# Altium schematic sheet CAN.SchDoc
size Letter
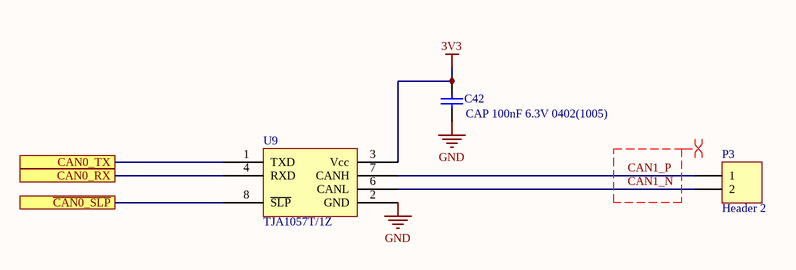
[diagram p0: CAN.SchDoc]

## Parts
C42  CAP 100nF 6.3V 0402(1005)  [CAPC0402(1005)60_M]
P3  Header 2  [HDR1X2]
U9  TJA1057T/1Z  [SOIC127P600X175-8N]

## Ports
CAN0_RX, CAN0_TX, ~{CAN0_SLP}

## Nets
3V3: C42.2 U9.3(Vcc)
GND: C42.1 U9.2(GND)
~{CAN0_SLP}: U9.8(~{SLP}) ; port ~{CAN0_SLP}
CAN0_RX: U9.4(RXD) ; port CAN0_RX
CAN0_TX: U9.1(TXD) ; port CAN0_TX
CAN1_N: P3.2 U9.6(CANL)
CAN1_P: P3.1 U9.7(CANH)

## Layout directives
differential pair: CAN1_N, CAN1_P

## Notes on the sheet
- Title
- Size:
- Date:
- Letter
- Number:
- Time:
- Revision:
- Sheet
- of
- Copyright 2019
- Specialized Solutions LLC
- 206 W Lincoln Hwy STE B
- New Haven, IN 46774
- www.specsolns.com <http://www.specsolns.com>
- File:

## Library data of the parts
C42 = CMP-1034-02062-1: CAP 100nF 6.3V ±20% 0402 (1005 Metric) Thickness 0.6mm SMD; Case-EIA: 0402; Tolerance: Â±20%; Case-Metric: 1005; Value: 100nF; Technology: SMT; Max Thickness: 0.6 mm; Rated Voltage: 6.3 V
P3 = Header 2: Header, 2-Pin; LatestRevisionDate: 17-Jul-2002; LatestRevisionNote: Re-released for DXP Platform.; Publisher: Altium Limited
U9 = TJA1057T/1Z: CAN-FD XVR 5v